# EAGLE schematic AudioAmp (EAGLE 6.5.0)
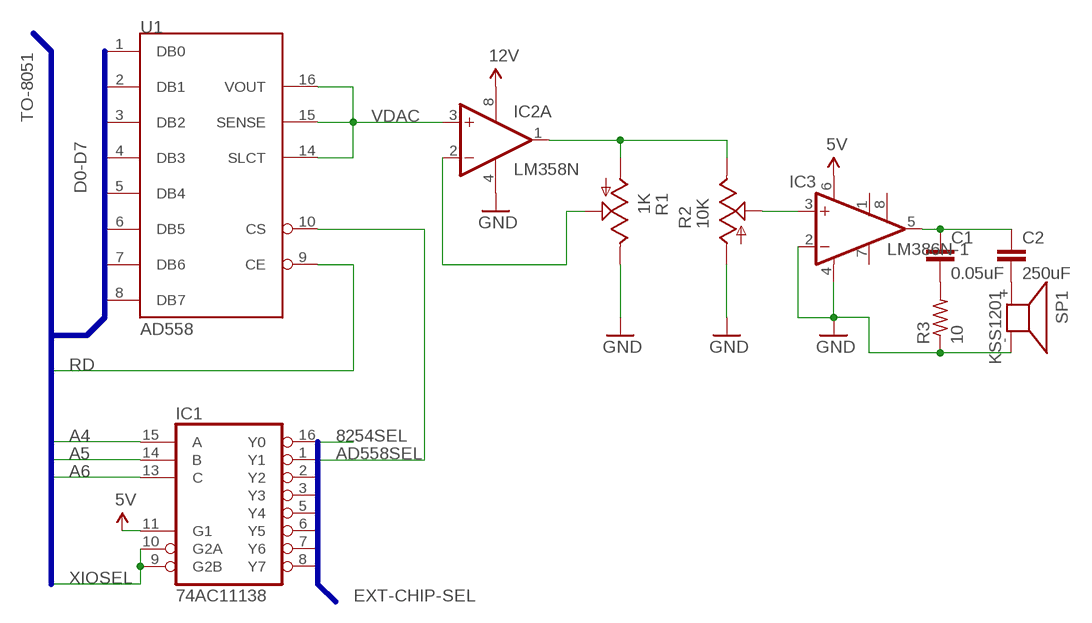
[diagram p0: schematic, sheet 1]

## Parts
C1  0.05uF  C-EU025_050-025X075  [C025_050-025X075]
C2  250uF  C-EU025_050-025X075  [C025_050-025X075]
IC1  74AC11138  [DIL16]
IC2  LM358N  [DIL08]
IC3  LM386N-1  [DIL08]
R1  1K  TRIM_US-3223G  [3223G]
R2  10K  TRIM_US-3223G  [3223G]
R3  10  R-US_0204/2V  [0204V]
SP1  KSS1201  [KSS1201]
U1  AD558  [DIL16]

## Nets
5V: IC1.11(G1) IC2.8(P:V+) IC3.6(VS) ; supply symbol labelled 12V
8254SEL: IC1.16(Y0)
A4: IC1.15(A)
A5: IC1.14(B)
A6: IC1.13(C)
AD558SEL: IC1.1(Y1) U1.10(CS)
GND: IC2.4(P:V-) IC3.2(-IN) IC3.4(GND) R1.3(E) R2.1(A) R3.1 SP1.-
N$1: IC2.1(A:OUT) R1.1(A) R2.3(E)
N$2: IC2.2(A:-IN) R1.2(S)
N$3: IC3.3(+IN) R2.2(S)
N$4: C2.2 SP1.+
N$5: C1.1 C2.1 IC3.5(OUT)
N$6: C1.2 R3.2
RD: U1.9(CE)
VDAC: IC2.3(A:+IN) U1.14(SLCT) U1.15(SENSE) U1.16(VOUT)
XIOSEL: IC1.9(G2B) IC1.10(G2A)
Unconnected: IC1.2(Y2) IC1.3(Y3) IC1.5(Y4) IC1.6(Y5) IC1.7(Y6) IC1.8(Y7) IC2.5(B:+IN) IC2.6(B:-IN) IC2.7(B:OUT) IC3.1(GAIN) IC3.7(BYPASS) IC3.8(GAIN) U1.1(DB0) U1.2(DB1) U1.3(DB2) U1.4(DB3) U1.5(DB4) U1.6(DB5) U1.7(DB6) U1.8(DB7)

## Buses
D0-D7
EXT-CHIP-SEL
TO-8051

## Power pins joined to a net without a drawn wire
GND: IC1.4(GND) U1.12(GND)
GND2: U1.13(GND2)
VCC: IC1.12(VCC) U1.11(VCC)

## Library data of the parts
C1 C2 = resistor:C-EU: CAPACITOR, European symbol
IC1 = 74ac-logic:74AC11138: 3 to 8 line DECODER/DEMULTIPLEXER
IC2 = linear:LM358: OP AMP also LM158; LM258; LM2904 Source: http://cache.national.com/ds/LM/LM158.pdf
IC3 = linear:LM386?-*: Low Voltage Audio Power Amplifier Source: http://cache.national.com/ds/LM/LM386.pdf
R1 R2 = pot:TRIM_US-: POTENTIOMETER
R3 = resistor:R-US_: RESISTOR, American symbol
SP1 = buzzer:KSS1201: SPEAKER Source: Schukat; OC_FARNELL: unknown; OC_NEWARK: unknown
U1 = AD558:AD558: Voltage-output 8-bit digital-to-analog converter The AD558 DACPORT is a complete voltage-output 8-bit digital-to-analog converter, including output amplifier, full microprocessor interface and precision voltage reference on a single monolithic chip. No external components or trims are required to interface, with full accuracy, an 8-bit data bus to an analog system.